# Altium schematic sheet NAND_MEMORY.SchDoc
size A2
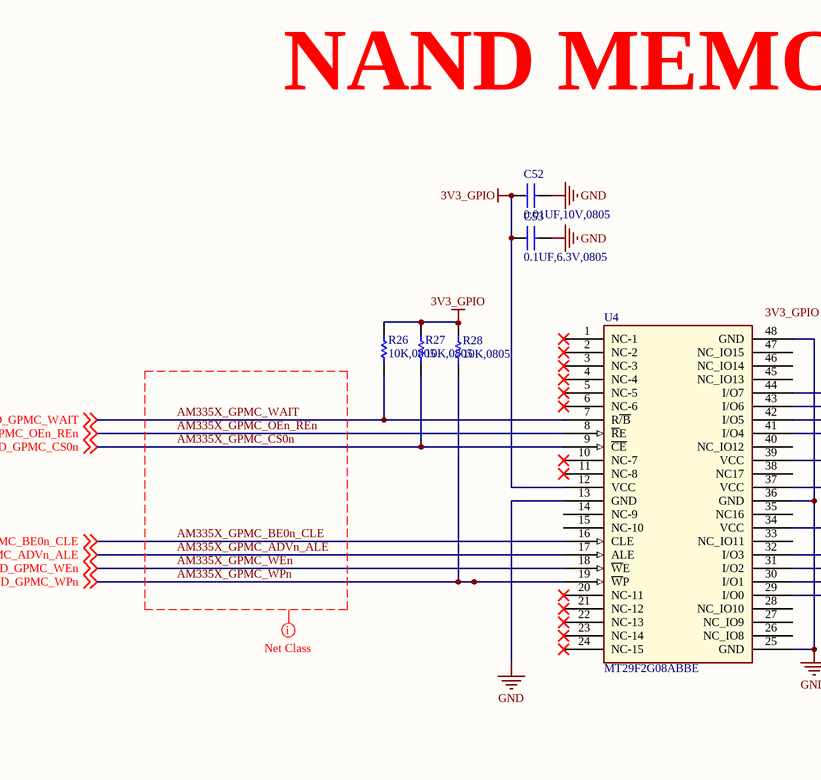
[diagram p0: NAND_MEMORY.SchDoc, left]
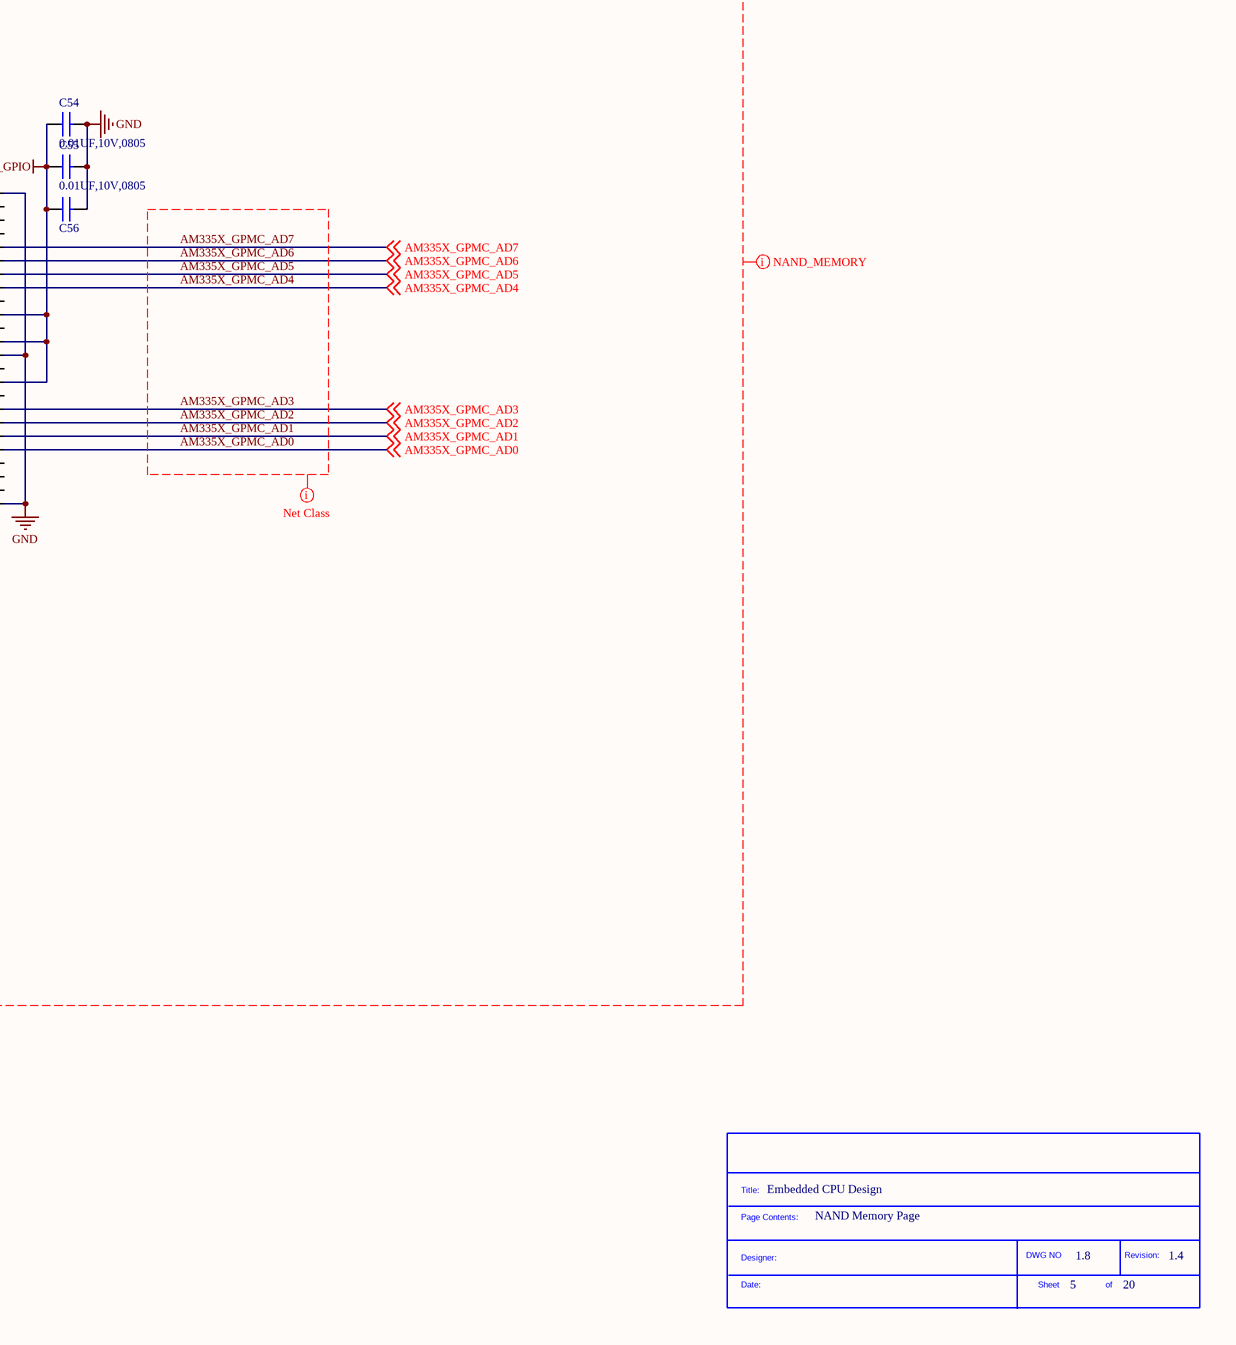
[diagram p1: NAND_MEMORY.SchDoc, right]

## Parts
*?  SDTitleBlock  (value not drawn)  (graphical)
C52  0.01UF,10V,0805  [0402]
C53  0.1UF,6.3V,0805  [0402]
C54  0.01UF,10V,0805  [0402]
C55  0.01UF,10V,0805  [0402]
C56  0.01UF,10V,0805  [0402]  (value not drawn)
R26  10K,0805  [0402]
R27  10K,0805  [0402]
R28  10K,0805  [0402]
U4  MT29F2G08ABBE  [skt-tsop48sm]

## Nets
3V3_GPIO: C52.1 C53.1 C54.1 C55.1 C56.1 R26.2 R27.2 R28.2 U4.12(VCC) U4.34(VCC) U4.37(VCC) U4.39(VCC)
GND: C52.2 C53.2 C54.2 C55.2 C56.2 U4.13(GND) U4.25(GND) U4.36(GND) U4.48(GND)
AM335X_GPMC_AD0: U4.29(I/O0) ; off-sheet AM335X_GPMC_AD0
AM335X_GPMC_AD1: U4.30(I/O1) ; off-sheet AM335X_GPMC_AD1
AM335X_GPMC_AD2: U4.31(I/O2) ; off-sheet AM335X_GPMC_AD2
AM335X_GPMC_AD3: U4.32(I/O3) ; off-sheet AM335X_GPMC_AD3
AM335X_GPMC_AD4: U4.41(I/O4) ; off-sheet AM335X_GPMC_AD4
AM335X_GPMC_AD5: U4.42(I/O5) ; off-sheet AM335X_GPMC_AD5
AM335X_GPMC_AD6: U4.43(I/O6) ; off-sheet AM335X_GPMC_AD6
AM335X_GPMC_AD7: U4.44(I/O7) ; off-sheet AM335X_GPMC_AD7
AM335X_GPMC_ADVn_ALE: U4.17(ALE) ; off-sheet NAND_GPMC_ADVn_ALE  [also labelled NAND_GPMC_ADVn_ALE]
AM335X_GPMC_BE0n_CLE: U4.16(CLE) ; off-sheet NAND_GPMC_BE0n_CLE  [also labelled NAND_GPMC_BE0n_CLE]
AM335X_GPMC_CS0n: R27.1 U4.9(~{CE}) ; off-sheet NAND_GPMC_CS0n  [also labelled NAND_GPMC_CS0n]
AM335X_GPMC_OEn_REn: U4.8(~{R}E) ; off-sheet NAND_GPMC_OEn_REn  [also labelled NAND_GPMC_OEn_REn]
AM335X_GPMC_WAIT: R26.1 U4.7(R~{/B}) ; off-sheet NAND_GPMC_WAIT  [also labelled NAND_GPMC_WAIT]
AM335X_GPMC_WEn: U4.18(~{W}E) ; off-sheet NAND_GPMC_WEn  [also labelled NAND_GPMC_WEn]
AM335X_GPMC_WPn: R28.1 U4.19(~{W}P) ; off-sheet NAND_GPMC_WPn  [also labelled NAND_GPMC_WPn]

Not connected (* = marked no-connect by the designer): U4 1(NC-1)* 2(NC-2)* 3(NC-3)* 4(NC-4)* 5(NC-5)* 6(NC-6)* 10(NC-7)* 11(NC-8)* 14(NC-9) 15(NC-10) 20(NC-11)* 21(NC-12)* 22(NC-13)* 23(NC-14)* 24(NC-15)* 26(NC_IO8) 27(NC_IO9) 28(NC_IO10) 33(NC_IO11) 35(NC16) 38(NC17) 40(NC_IO12) 45(NC_IO13) 46(NC_IO14) 47(NC_IO15)

## Layout directives
net class NAND: AM335X_GPMC_ADVn_ALE, AM335X_GPMC_BE0n_CLE, AM335X_GPMC_CS0n, AM335X_GPMC_OEn_REn, AM335X_GPMC_WAIT, AM335X_GPMC_WEn, AM335X_GPMC_WPn
net class NAND_GPMC: AM335X_GPMC_AD0, AM335X_GPMC_AD1, AM335X_GPMC_AD2, AM335X_GPMC_AD3, AM335X_GPMC_AD4, AM335X_GPMC_AD5, AM335X_GPMC_AD6, AM335X_GPMC_AD7
net class NAND_MEMORY: 3V3_GPIO, AM335X_GPMC_AD0, AM335X_GPMC_AD1, AM335X_GPMC_AD2, AM335X_GPMC_AD3, AM335X_GPMC_AD4, AM335X_GPMC_AD5, AM335X_GPMC_AD6, AM335X_GPMC_AD7, AM335X_GPMC_ADVn_ALE, AM335X_GPMC_BE0n_CLE, AM335X_GPMC_CS0n, AM335X_GPMC_OEn_REn, AM335X_GPMC_WAIT, AM335X_GPMC_WEn, AM335X_GPMC_WPn, GND, NAND_GPMC_ADVn_ALE, NAND_GPMC_BE0n_CLE, NAND_GPMC_CS0n, NAND_GPMC_OEn_REn, NAND_GPMC_WAIT, NAND_GPMC_WEn, NAND_GPMC_WPn

## Notes on the sheet
- NAND MEMORY
- Embedded CPU Design
- NAND Memory Page
- 5
- 1.8
- 20
- 1.4
- (in symbol SDTitleBlock) Title:; Page Contents:; Designer:; DWG NO; Revision:; Date:; Sheet; of

## Library data of the parts
C52 C54-C56 = 0.01UF,10V,0805: MULTICOMP - MCSH21B103K100CT - CAP, MLCC, X7R, 10NF, 10V, 0805; Capacitance: 10000pF; Tolerance: ±10%; Voltage - Rated: 16V; Supplier 1: Digi-Key; Manufacturer: MULTICOMP; Manufacturer Part Number: MCSH21B103K100CT; RoHS: YES; Stock 1: 21284; Pricing 1: 1=0.24, 10=0.2, 50=0.1126, 100=0.1, 250=0.075, 500=0.06626, 1000=0.05875 (USD); ComponentLink1URL: http://www.farnell.com/datasheets/1825494.pdf; ComponentLink1Description: http://www.farnell.com/datasheets/1825494.pdf; Supplier Part Number 1: 399-7995-1-ND; Category: Capacitors; Packaging: Cut Tape (CT); Temperature Coefficient: X7R; Mounting Type: Surface Mount, MLCC; Operating Temperature: -55°C ~ 125°C; Applications: General Purpose; Ratings: -; Package / Case: 0805 (2012 Metric); Size / Dimension: 0.079" L x 0.049" W (2.00mm x 1.25mm); Height - Seated (Max): -; Thickness (Max): 0.035" (0.88mm); Lead Spacing: -; Features: -; Lead Style: -; ComponentLink2URL: http://www.kemet.com/docfinder?Partnumber=C0805C103K4RACTU; ComponentLink2Description: http://www.kemet.com/docfinder?Partnumber=C0805C103K4RACTU
C53 = 0.1UF,6.3V,0805: CAP CER 0.1UF 6.3V 10% X7R 0805; Manufacturer: Kemet; Manufacturer Part Number: C0805C104K9RACTU; Capacitance: 0.1µF; Supplier 1: Digi-Key; RoHS: RoHS Compliant; Category: Capacitors; Stock 1: 19204; Pricing 1: 1=0.12, 10=0.083, 25=0.062, 50=0.0476, 100=0.0392, 250=0.03304, 1000=0.02228 (USD); Packaging: Digi-Reel®; Tolerance: ±10%; Voltage - Rated: 6.3V; Temperature Coefficient: X7R; Mounting Type: Surface Mount, MLCC; Operating Temperature: -55°C ~ 125°C; Applications: General Purpose; Ratings: -; Package / Case: 0805 (2012 Metric); Size / Dimension: 0.079" L x 0.049" W (2.00mm x 1.25mm); Height - Seated (Max): -; Thickness (Max): 0.035" (0.88mm); Lead Spacing: -; Features: -; Lead Style: -; ComponentLink1URL: http://www.kemet.com/docfinder?Partnumber=C0805C104K9RACTU; ComponentLink1Description: http://www.kemet.com/docfinder?Partnumber=C0805C104K9RACTU; Supplier Part Number 1: 399-9155-6-ND
R26-R28 = 10K,0805: BOURNS - CR0805-FX-1002GLF - RESISTOR, 10K, 0.125W, 1%; Product Range: BOURNS - CR Series; Resistance: 10; Power Rating: 125; Resistor Case Style: 0805 [2012 Metric]; Resistor Element Material: Thick Film; Temperature Coefficient: ± 100; Voltage Rating: 150; SVHC: No SVHC (16-Jun-2014); Resistor Mounting: SMD<!--FANDB--><div class="features-and-benefits-container"></div>; Power (Watts): 0.125W, 1/8W; Supplier 1: Digi-Key; Manufacturer: BOURNS; Manufacturer Part Number: CR0805-FX-1002GLF; RoHS: YES; Stock 1: 1116166; Pricing 1: 1=0.1, 10=0.029, 50=0.0162, 100=0.0123, 250=0.00912, 500=0.00672, 1000=0.00448, 2500=0.00378 (USD); Resistance Tolerance: ± 1%; Packaging: Cut Tape; MSL: MSL 1 - Unlimited; ComponentLink1URL: http://www.farnell.com/datasheets/1845293.pdf; ComponentLink1Description: http://www.farnell.com/datasheets/1845293.pdf; Supplier Part Number 1: RMCF0805FT10K0CT-ND; Category: Resistors; Resistance (Ohms): 10k; Tolerance: ±1%; Composition: Thick Film; Features: -; Operating Temperature: -55°C ~ 155°C; Package / Case: 0805 (2012 Metric); Supplier Device Package: 0805; Size / Dimension: 0.079" L x 0.049" W (2.00mm x 1.25mm); Height: 0.026" (0.65mm); Number of Terminations: 2; ComponentLink2URL: http://www.seielect.com/Catalog/SEI-RMCF_RMCP.pdf; ComponentLink2Description: http://www.seielect.com/Catalog/SEI-RMCF_RMCP.pdf
U4 = MT29F2G08ABBE: NAND 2Gb Flash Memory x08 width 3.3V; TIIntPartnumber: 1A0255; MfrNum: MT29F2G08ABAEAWP; Mfr: Micron; Cost10K: 3.12; Cost100: 7.1; Vendor: Arrow; DescriptiveText: NAND 2Gb Flash Memory x08 width 3.3V; PartName: MT29F2G08AB; Descriptive_Text: NAND 2Gb Flash Memory x08 width 3.3V; Supplier 1: Digi-Key; Supplier Part Number 1: 557-1487-1-ND